# EasyEDA Pro project ProDoc_ESP32_V2_Interface Board_Abed_2025-12-05.epro

# Schematic ESP8266_Interface Schematic

## Sheets
1 Minsys: Board Name: ESP32_V2_Interface Board_Abed; Create Date: 2025-10-08; Page Name: Minsys; Project Name: Pjbl3_2025-2026; Schematic Name: ESP8266_Interface Schematic; Update Date: 2025-10-18; Company: EasyEDA.com; Page Size: A4; Version: V1.0
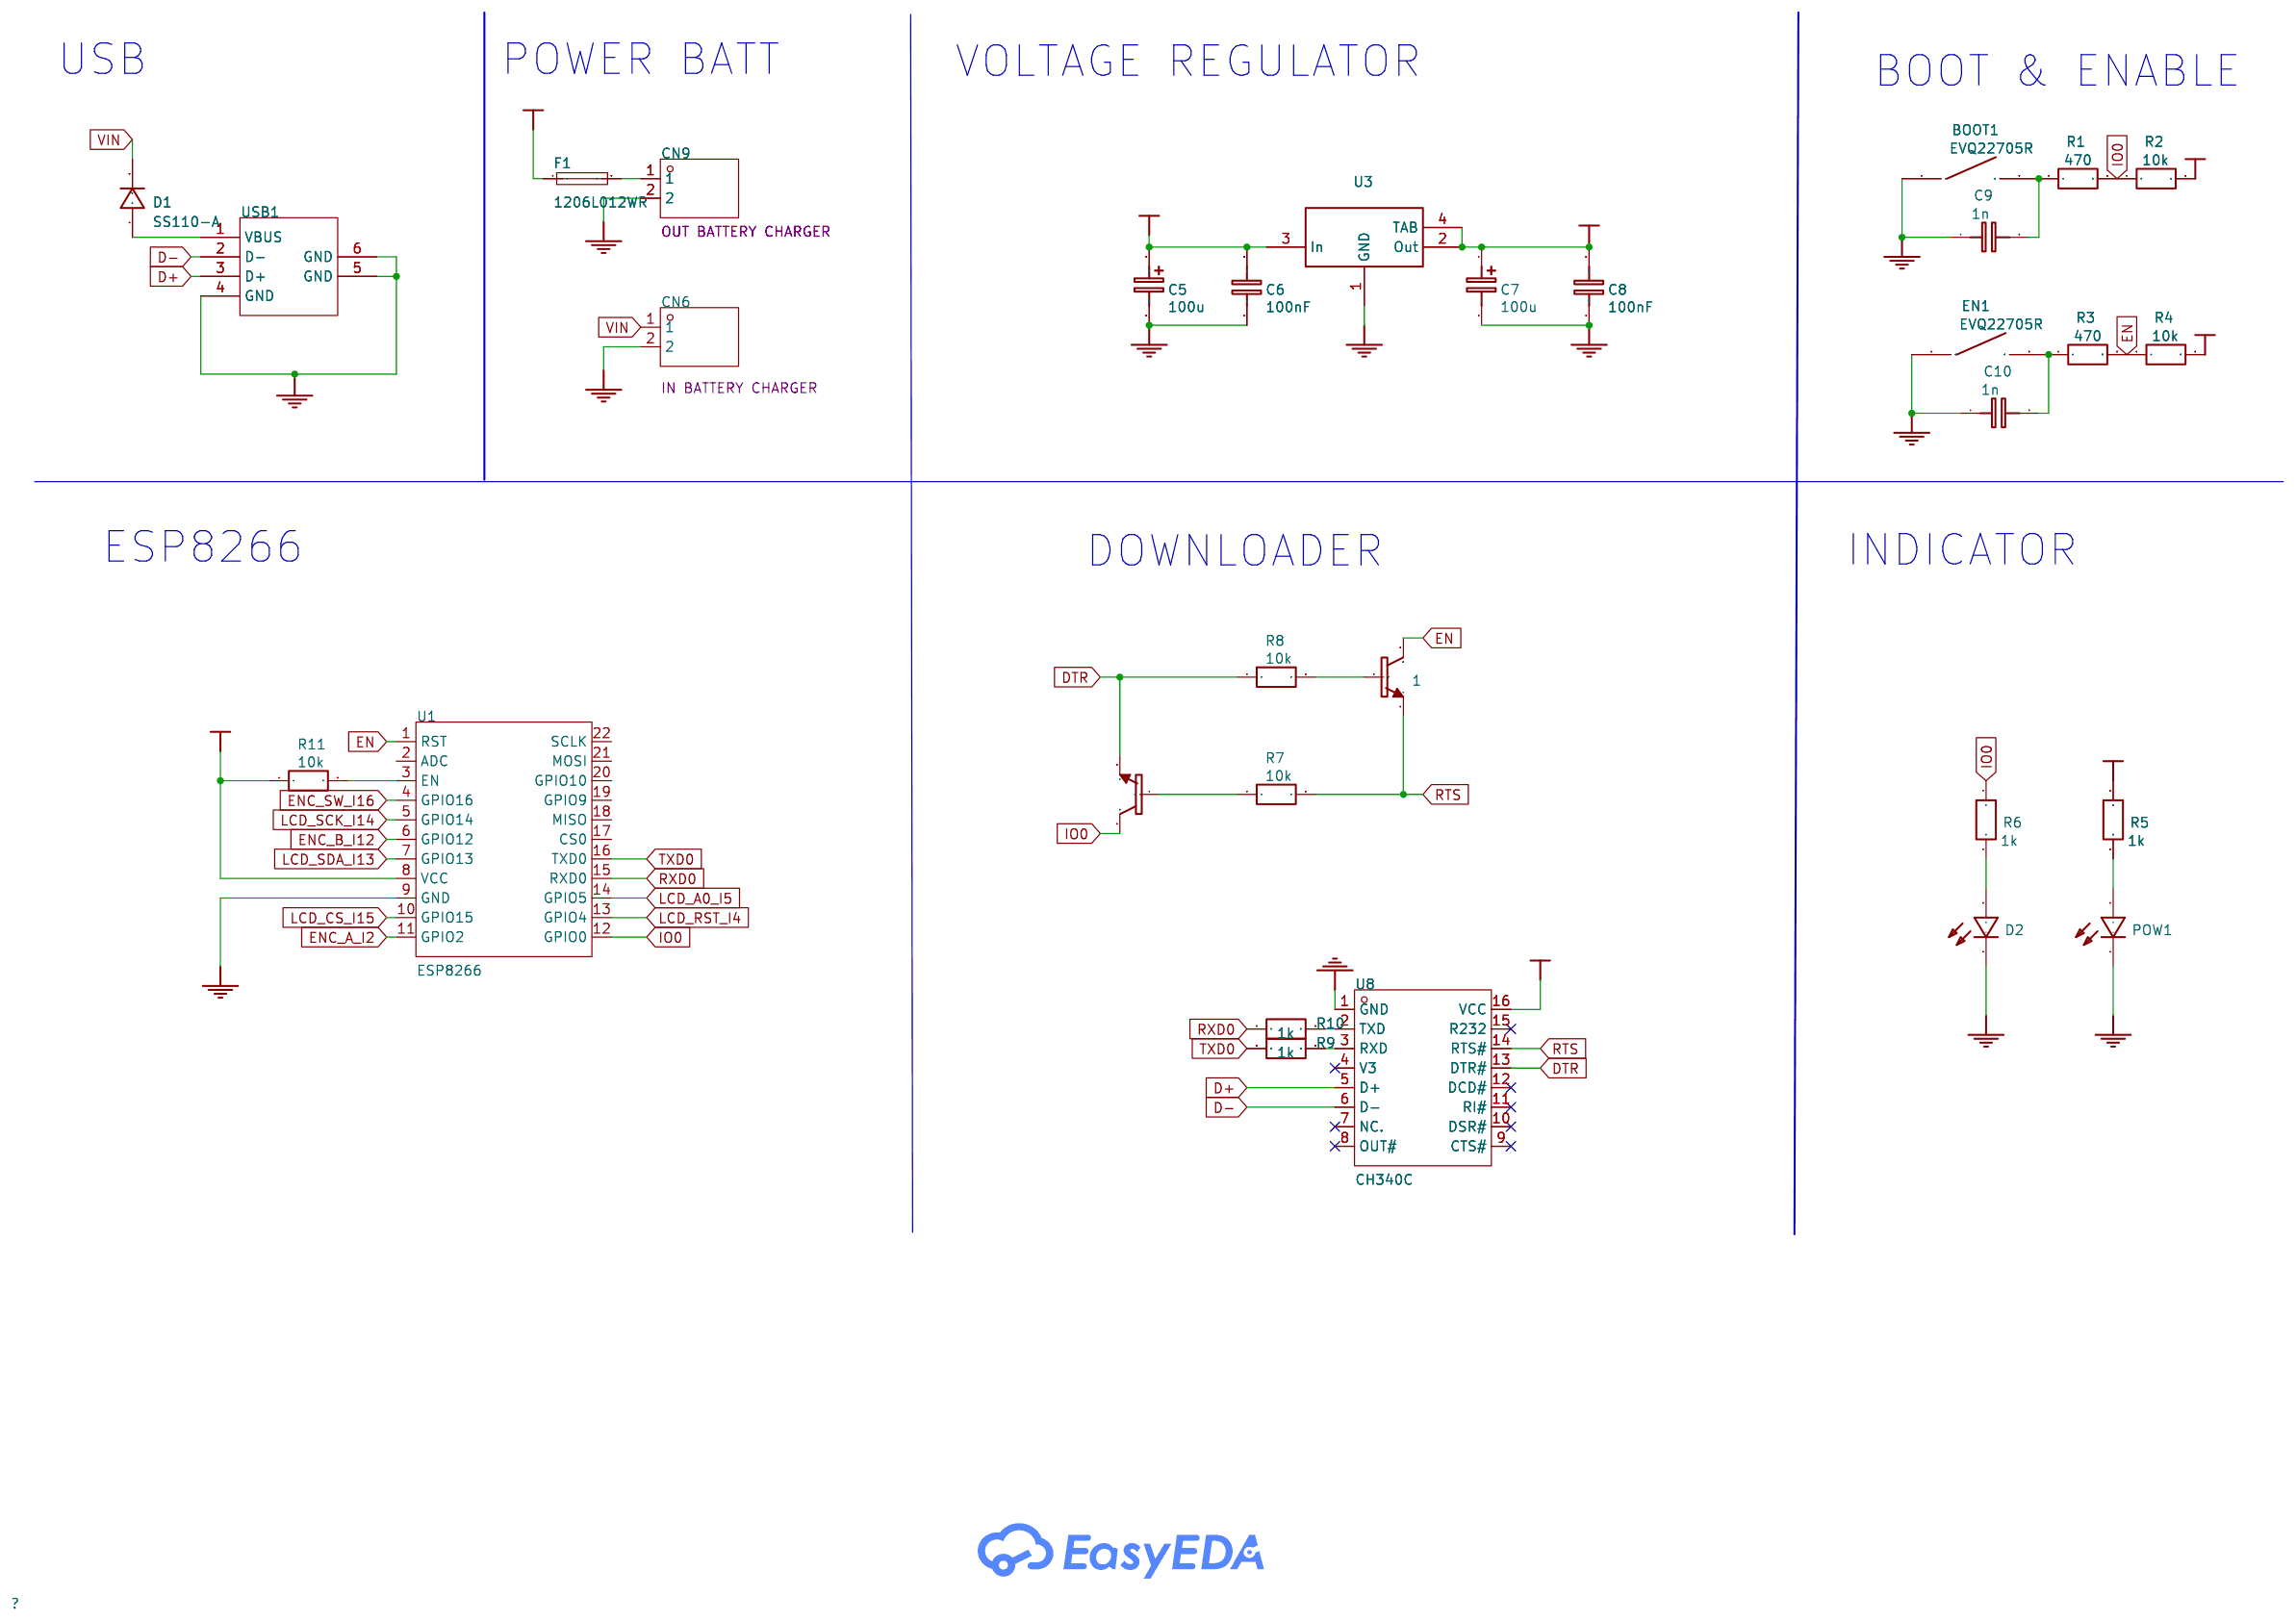
[diagram p0: Minsys]
2 INTERFACE: Page Name: INTERFACE; Schematic Name: ESP32_Interface Schematic; Update Date: 2025-10-09
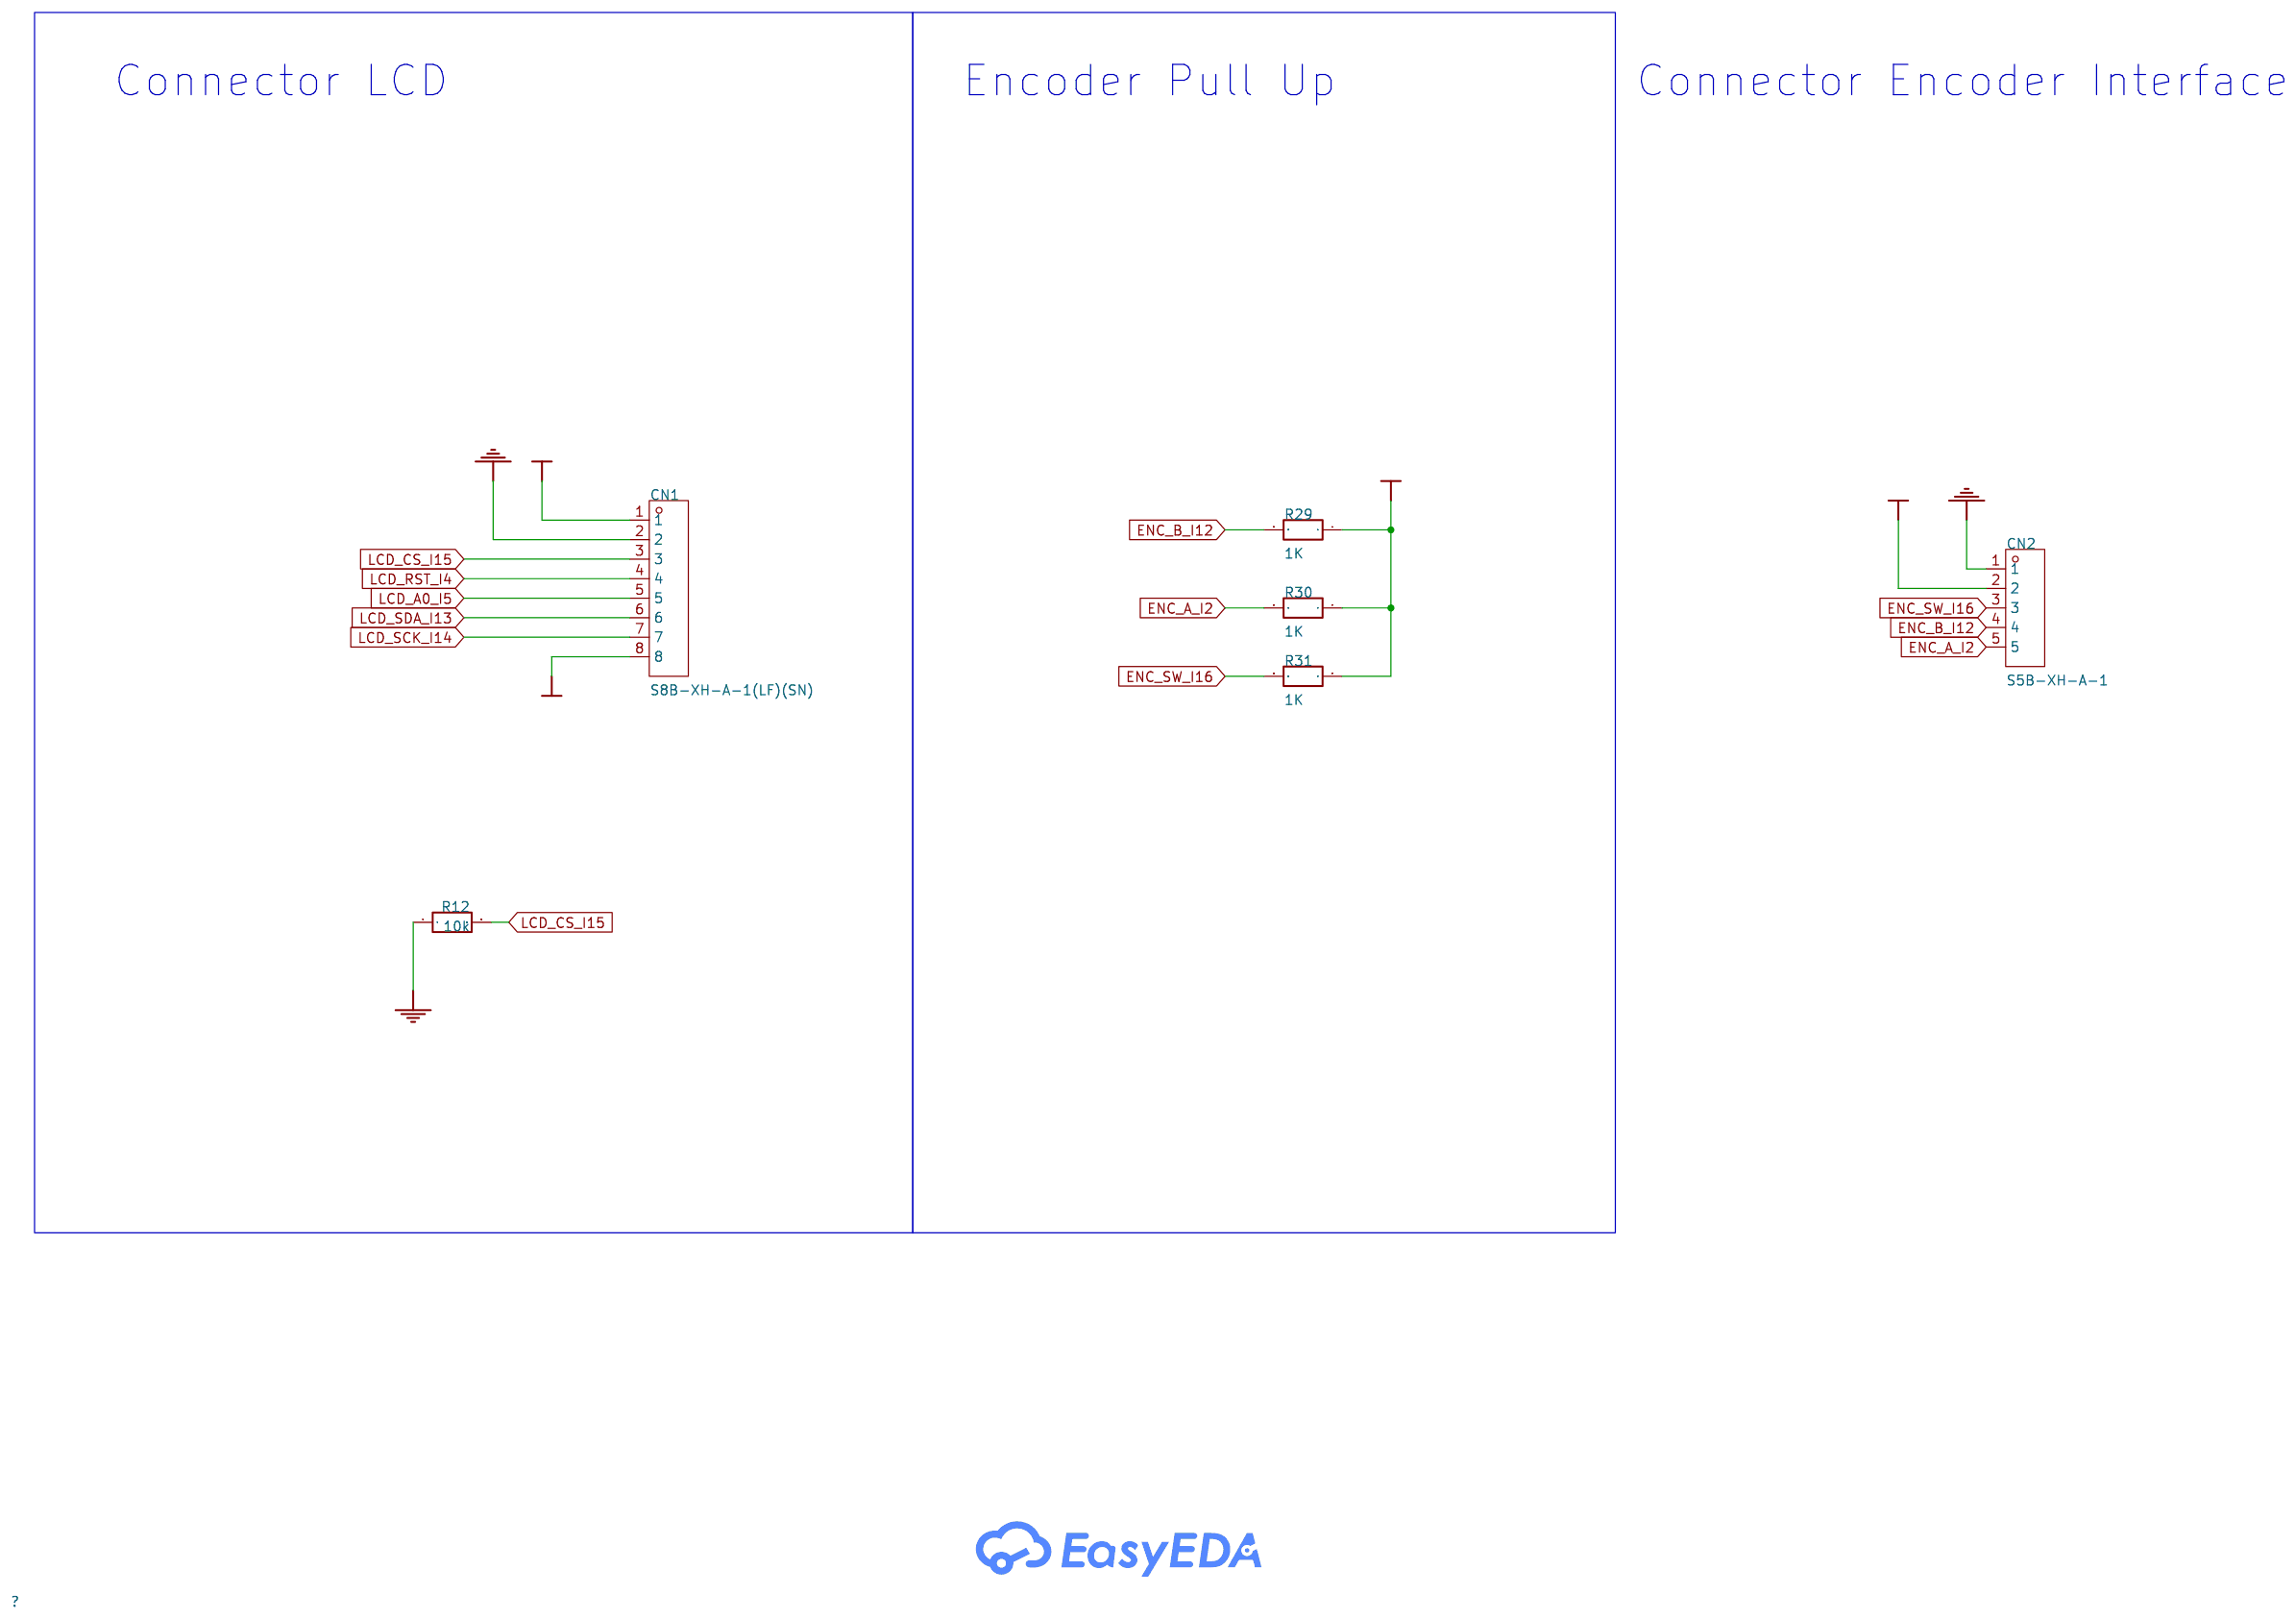
[diagram p1: INTERFACE]

## Parts
sheet INTERFACE
CN1  S8B-XH-A-1(LF)(SN)  [CONN-TH_S8B-XH-A-1-LF-SN]
CN2  S5B-XH-A-1  [CONN-TH_S5B-XH-A-1-LF-SN]
R12  10k  [R0603]
R29  1K  [R0603]
R30  1K  [R0603]
R31  1K  [R0603]
sheet Minsys
1  MMBT3904  [SOT-23-3_L2.9-W1.3-P1.90-LS2.4-BR]
2  MMBT3904  [SOT-23-3_L2.9-W1.3-P1.90-LS2.4-BR]
BOOT1  EVQ22705R  [SMD_PUSH]
C5  100u  [CASE-A_3216]
C6  100nF  [C0603]
C7  100u  [CASE-A_3216]
C8  100nF  [C0603]
C9  1n  [C0603]
C10  1n  [C0603]
CN6  S2B-XH-A-1(LF)(SN)  [CONN-TH_S2B-XH-A-1-LF-SN]
CN9  S2B-XH-A-1(LF)(SN)  [CONN-TH_S2B-XH-A-1-LF-SN]
D1  SS110-A  [D0805]
D2  17-21/BHC-XL2M2TY/3T  [LED0805-RD_BLUE]
EN1  EVQ22705R  [SMD_PUSH]
F1  1206L012WR  [F1206]
POW1  17-21/BHC-XL2M2TY/3T  [LED0805-RD_BLUE]
R1  470  [R0603]
R2  10k  [R0603]
R3  470  [R0603]
R4  10k  [R0603]
R5  1k  [R0603]
R6  1k  [R0603]
R7  10k  [R0603]
R8  10k  [R0603]
R9  1k  [R0603]
R10  1k  [R0603]
R11  10k  [R0603]
U1  ESP8266  [WIFIM-SMD_ESP-12F-ESP8266MOD]
U3  AMS1117-3.3  [SOT-223-3_L6.5-W3.4-P2.30-LS7.0-BR]
U8  CH340C  [SOP-16_L10.0-W3.9-P1.27-LS6.0-BL]
USB1  USB-B01  [USB-B-TH_USB-B01]

## Library data of the parts
CN1 = S8B-XH-A-1(LF)(SN)_C5306549: Pins Structure:1x8P Pitch:2.5mm Mounting Type:Right Angle Reference Series:XH Number of Pins:8P Number of Rows:1 Number of PINs Per Row:8 Row Spacing:- Current Rating:3A Contact Material:Brass Contact Plating:Tin Operating Temperature:-25℃~+85℃ Operating; LCSC Part Name: 1x8P 间距:2.5mm 弯插 系列:XH; Supplier Part: C5306549; Manufacturer: JST; Supplier Footprint: 弯插,P=2.5mm; JLCPCB Part Class: Extended Part; Datasheet: https://item.szlcsc.com/datasheet/S8B-XH-A-1(LF)(SN)/6058854.html; Supplier: LCSC; Pins Structure: 1x8P; Pitch: 2.5mm; Mounting Type: Right Angle; Reference Series: XH; Number of Pins: 8P; Number of Rows: 1; Number of PINs Per Row: 8; Current Rating: 3A; Contact Material: Brass; Contact Plating: Tin; Operating Temperature: -25℃~+85℃; Voltage Rating: 250V; Plastic Material: PA66; Flame Retardant Rating: UL94V-0; Supplementary Features: K Pin; Color: White; Z-Height of the Board: 6.1mm; X-Length of Bottom Edge on Board (Spacing Line): 22.4mm; Y-Width of Bottom Edge on Board: 11.5mm
CN2 = S5B-XH-A-1: Pins Structure:1x5P Pitch:2.5mm Mounting Type:Bend-in Reference Series:XH Number of Pins:5P Number of Rows:1 Number of PINs Per Row:5 Row Spacing:- Current Rating:3A Contact Material:Brass Contact Plating:Tin Operating Temperature:-25℃~+85℃ Operating Temp; LCSC Part Name: 1x5P 间距:2.5mm 弯插 系列:XH; Supplier Part: C20461711; Manufacturer: JST; Supplier Footprint: 弯插,P=2.5mm; Datasheet: https://item.szlcsc.com/datasheet/S5B-XH-A-1/21800327.html; Supplier: LCSC; Pins Structure: 1x5P; Pitch: 2.5mm; Mounting Type: Bend-in; Reference Series: XH; Number of Pins: 5P; Number of Rows: 1; Number of PINs Per Row: 5; Current Rating: 3A; Contact Material: Brass; Contact Plating: Tin; Operating Temperature: -25℃~+85℃; Voltage Rating: 250V; Plastic Material: PA66; Flame Retardant Rating: UL94V-0; Supplementary Features: K-leg punch; Color: White; Z-Height of the Board: 6.1mm; X-Length of Bottom Edge on Board (Spacing Line): 14.9mm; Y-Width of Bottom Edge on Board: 11.5mm
R2 R4 R7 R8 R11 R12 R29-R31 = 10k: nameAlias: Value(Ω); spicePre: R; spiceSymbolName: Res_0805(1/8W)_EU
1 2 = MMBT3904_C18195365: type:NPN Current - Collector(Ic):200mA Collector - Emitter Voltage VCEO:40V Pd - Power Dissipation:200mW Transition frequency(fT):300MHz Current - Collector Cutoff:100nA Vce Saturation(VCE(sat)):300mV@50mA,5mA Emitter-Base Voltage(Vebo):6V Number:1 NPN; LCSC Part Name: NPN 电流:0.2A 电压:40V; Supplier Part: C18195365; Manufacturer: LJ(朗捷); Supplier Footprint: SOT-23; JLCPCB Part Class: Extended Part; Datasheet: https://item.szlcsc.com/datasheet/MMBT3904/19344752.html; Supplier: LCSC; type: NPN; Current - Collector(Ic): 200mA; Collector - Emitter Voltage VCEO: 40V; Pd - Power Dissipation: 200mW; Transition frequency(fT): 300MHz; Current - Collector Cutoff: 100nA; Vce Saturation(VCE(sat)): 300mV@50mA,5mA; Emitter-Base Voltage(Vebo): 6V; Number: 1 NPN
BOOT1 EN1 = EVQ22705R: Supplier: LCSC; Manufacturer: PANASONIC; Supplier Part: C79156; Contributor: LCSC; spicePre: S
C5 C7 = 100u: nameAlias: Value(F); Contributor: LCEDA_Lib; spicePre: C; spiceSymbolName: C_Tan_SMD_A_EU
C6 C8 = 100nF: nameAlias: Value(F); Contributor: LCEDA_Lib; spicePre: C; spiceSymbolName: C_0603_EU
C9 C10 = 1n: nameAlias: Value(F); spicePre: C; spiceSymbolName: Cap_0805_EU
CN6 = S2B-XH-A-1(LF)(SN): IN BATTERY CHARGER; LCSC Part Name: 1x2P 间距:2.5mm 弯插 系列:XH; Supplier Part: C163035; Manufacturer: JST; Supplier Footprint: 弯插,P=2.5mm; JLCPCB Part Class: Extended Part; Datasheet: https://item.szlcsc.com/datasheet/S2B-XH-A-1(LF)(SN)/174416.html; Supplier: LCSC; Pins Structure: 1x2P; Pitch: 2.5mm; Mounting Type: Right Angle; Reference Series: XH; Number of Pins: 2P; Number of Rows: 1; Number of PINs Per Row: 2; Current Rating: 3A; Contact Material: Brass; Contact Plating: Tin; Operating Temperature: -25℃~+85℃; Voltage Rating: 250V; Plastic Material: PA66; Flame Retardant Rating: UL94V-0; Supplementary Features: K Pin; Color: White; Z-Height of the Board: 6.1mm; X-Length of Bottom Edge on Board (Spacing Line): 7.4mm; Y-Width of Bottom Edge on Board: 11.5mm
CN9 = S2B-XH-A-1(LF)(SN): OUT BATTERY CHARGER; LCSC Part Name: 1x2P 间距:2.5mm 弯插 系列:XH; Supplier Part: C163035; Manufacturer: JST; Supplier Footprint: 弯插,P=2.5mm; JLCPCB Part Class: Extended Part; Datasheet: https://item.szlcsc.com/datasheet/S2B-XH-A-1(LF)(SN)/174416.html; Supplier: LCSC; Pins Structure: 1x2P; Pitch: 2.5mm; Mounting Type: Right Angle; Reference Series: XH; Number of Pins: 2P; Number of Rows: 1; Number of PINs Per Row: 2; Current Rating: 3A; Contact Material: Brass; Contact Plating: Tin; Operating Temperature: -25℃~+85℃; Voltage Rating: 250V; Plastic Material: PA66; Flame Retardant Rating: UL94V-0; Supplementary Features: K Pin; Color: White; Z-Height of the Board: 6.1mm; X-Length of Bottom Edge on Board (Spacing Line): 7.4mm; Y-Width of Bottom Edge on Board: 11.5mm
D1 = SS110-A: Supplier Part: C143192; Supplier: LCSC; Manufacturer: FMS; Contributor: LCSC; spicePre: D
D2 POW1 = 17-21/BHC-XL2M2TY/3T: Supplier: LCSC; Manufacturer: EVERLIGHT; image: //image.lceda.cn/szlcsc/C72035.jpg; Supplier Part: C72035; JLCPCB Part Class: Extend; LCSC Assembly: Yes; spicePre: L
F1 = 1206L012WR: Voltage - Max:30V Current - Max:100A Hold Current:125mA Trip Current:290mA Power Dissipation:- Resistance - Initial (Ri) (Min):1.5Ω Resistance - Post Trip (R1) (Max):6Ω Time to Trip(Max):200ms Operating Temperature:-40℃~+85℃ Operating Temperature:-40℃~+85; LCSC Part Name: 30V 125mA 1206自恢复; Supplier Part: C151160; Manufacturer: Littelfuse(美国力特); Supplier Footprint: 1206; Datasheet: https://item.szlcsc.com/datasheet/1206L012WR/162500.html; Supplier: LCSC; Voltage - Max: 30V; Current - Max: 100A; Hold Current: 125mA; Trip Current: 290mA; Resistance - Initial (Ri) (Min): 1.5Ω; Resistance - Post Trip (R1) (Max): 6Ω; Time to Trip(Max): 200ms; Operating Temperature: -40℃~+85℃
R1 R3 = 470: nameAlias: Value(Ω); spicePre: R; spiceSymbolName: Res_0805(1/8W)_EU
R5 R6 = 1k: nameAlias: Value(Ω); spicePre: R; spiceSymbolName: Res_0805(1/8W)_EU
R9 R10 = 1k: nameAlias: Value(Ω); Contributor: LCEDA_Lib; spicePre: R; spiceSymbolName: R_AXIAL-0.5_EU
U1 = ESP8266: Supplier Part: C9900003049; Supplier Footprint: WIFIM-SMD; Supplier: LCSC
U3 = AMS1117-3.3_C18212698: Output Type:Fixed Voltage - Supply:12V Output Voltage:3.3V Output Voltage:3.3V Output Current:1A Power Supply Rejection Ratio (PSRR):- Voltage Dropout:1.3V@(1A) standby current:4mA Noise:- Features:- Operating Temperature:- Operating Temperature:- Output; Supplier Part: C18212698; Manufacturer: TECH PUBLIC(台舟); Supplier Footprint: SOT-223; JLCPCB Part Class: Extended Part; Datasheet: https://item.szlcsc.com/datasheet/AMS1117-3.3/19384486.html; Supplier: LCSC; Output Type: Fixed; Voltage - Supply: 12V; Output Voltage: 3.3V; Output Current: 1A; Voltage Dropout: 1.3V@(1A); standby current: 4mA; Output Configuration: Positive; Number of Outputs: 1
U8 = CH340C: Applications Function:Transceiver USB Protocol:USB 2.0 Voltage - Supply:3.3V；5V Voltage - Supply:3.3V；5V Data Rate:2Mbps Operating Temperature:-20℃~+70℃ Operating Temperature:-20℃~+70℃ Current - Supply:7mA Supply Current (Iq):50uA; LCSC Part Name: USB转串口芯片; Supplier Part: C84681; Manufacturer: WCH(南京沁恒); Supplier Footprint: SOP-16; Datasheet: https://item.szlcsc.com/datasheet/CH340C/85852.html; Supplier: LCSC; Applications Function: Transceiver; USB Protocol: USB 2.0; Voltage - Supply: 3.3V；5V; Data Rate: 2Mbps; Operating Temperature: -20℃~+70℃; Current - Supply: 7mA; Supply Current (Iq): 50uA
USB1 = USB-B01: Connector Type:Type-B Standard:USB 2.0 Gender:Mother Mounting Style:Bend-in Number of Contacts:4P Number of Ports:1 Current Rating - Power (Max):- Operating Temperature Range:- Operating Temperature Range:-; LCSC Part Name: Type-B 母 弯插; Supplier Part: C498173; Manufacturer: SOFNG(硕方); Supplier Footprint: 插件; JLCPCB Part Class: Extended Part; Datasheet: https://atta.szlcsc.com/upload/public/pdf/source/20241205/E91F6EB45793D6E28E6049372FBBC2AE.pdf; Supplier: LCSC; Connector Type: Type-B; Standard: USB 2.0; Gender: Mother; Mounting Style: Bend-in; Number of Contacts: 4P; Number of Ports: 1

## Nets
3V3: C7.1 C8.2 CN1.1 CN2.2 R2.2 R4.2 R5.1 R11.1 R29.1 R30.1 R31.1 U1.8(VCC) U3.2(Out) U3.4(TAB)
+5V: C5.1 C6.2 CN1.8 F1.1 U3.3(In) U8.16(VCC)
GND: BOOT1.1 C5.2 C6.1 C7.2 C8.1 C9.1 C10.1 CN1.2 CN2.1 CN6.2 CN9.2 D2.1(-) EN1.1 POW1.1(-) R12.1 U1.9(GND) U3.1(GND) U8.1(GND) USB1.4(GND) USB1.5(GND) USB1.6(GND)
VIN: CN6.1 D1.2
D+: U8.5(D+) USB1.3(D+)
D-: U8.6(D-) USB1.2(D-)
DTR: 2.3(E) R8.1 U8.13(DTR#)
EN: 1.2(C) R3.2 R4.1 U1.1(RST)
ENC_A_I2: CN2.5 R30.2 U1.11(GPIO2)
ENC_B_I12: CN2.4 R29.2 U1.6(GPIO12)
ENC_SW_I16: CN2.3 R31.2 U1.4(GPIO16)
IO0: 2.2(C) R1.2 R2.1 R6.1 U1.12(GPIO0)
LCD_A0_I5: CN1.5 U1.14(GPIO5)
LCD_CS_I15: CN1.3 R12.2 U1.10(GPIO15)
LCD_RST_I4: CN1.4 U1.13(GPIO4)
LCD_SCK_I14: CN1.7 U1.5(GPIO14)
LCD_SDA_I13: CN1.6 U1.7(GPIO13)
RTS: 1.3(E) R7.2 U8.14(RTS#)
RXD0: R10.1 U1.15(RXD0)
TXD0: R9.1 U1.16(TXD0)
$1N1092: D1.1 USB1.1(VBUS)
$1N1637: 2.1(B) R7.1
$1N1639: 1.1(B) R8.2
$1N1721: R11.2 U1.3(EN)
$1N2228: D2.2(+) R6.2
$1N5068: R9.2 U8.3(RXD)
$1N5069: R10.2 U8.2(TXD)
Net-(BOOT1-2): BOOT1.2 C9.2 R1.1
Net-(C10-2): C10.2 EN1.2 R3.1
Net-(CN9-1): CN9.1 F1.2
Net-(POW1-2): POW1.2(+) R5.2

Not connected (* = marked no-connect by the designer): U1 2(ADC) 17(CS0) 18(MISO) 19(GPIO9) 20(GPIO10) 21(MOSI) 22(SCLK); U8 4(V3)* 7(NC.)* 8(OUT#)* 9(CTS#)* 10(DSR#)* 11(RI#)* 12(DCD#)* 15(R232)*

## Notes on the sheets
sheet 1
- USB
- POWER BATT
- VOLTAGE REGULATOR
- BOOT & ENABLE
- ESP8266
- DOWNLOADER
- INDICATOR
sheet 2
- Connector LCD
- Encoder Pull Up
- Connector Encoder Interface

# Board ESP8266_INTERFACE BOARD
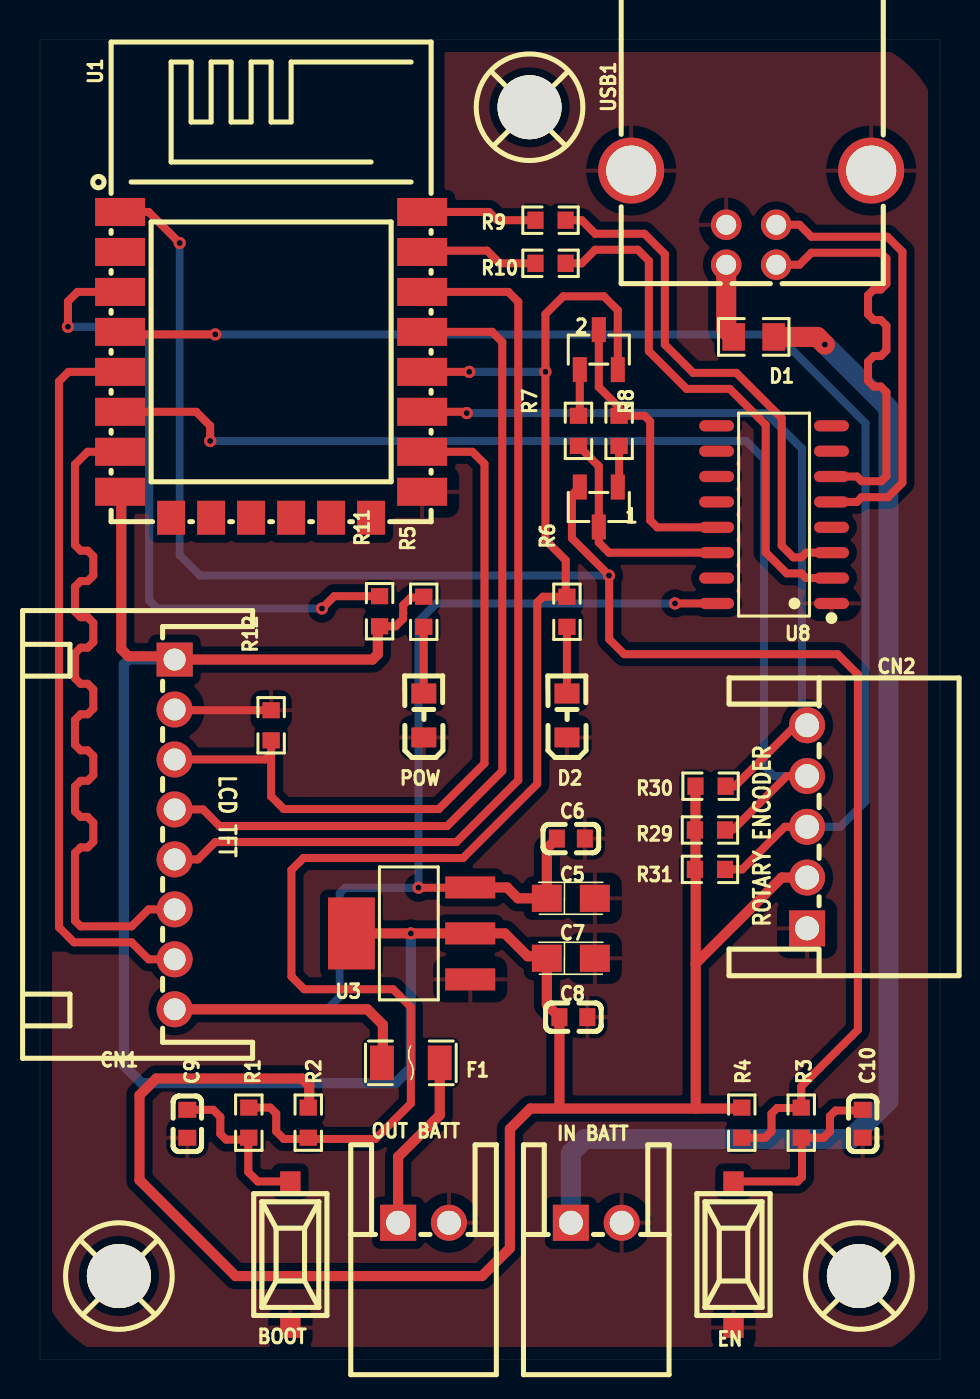
[diagram p2: board, top side]
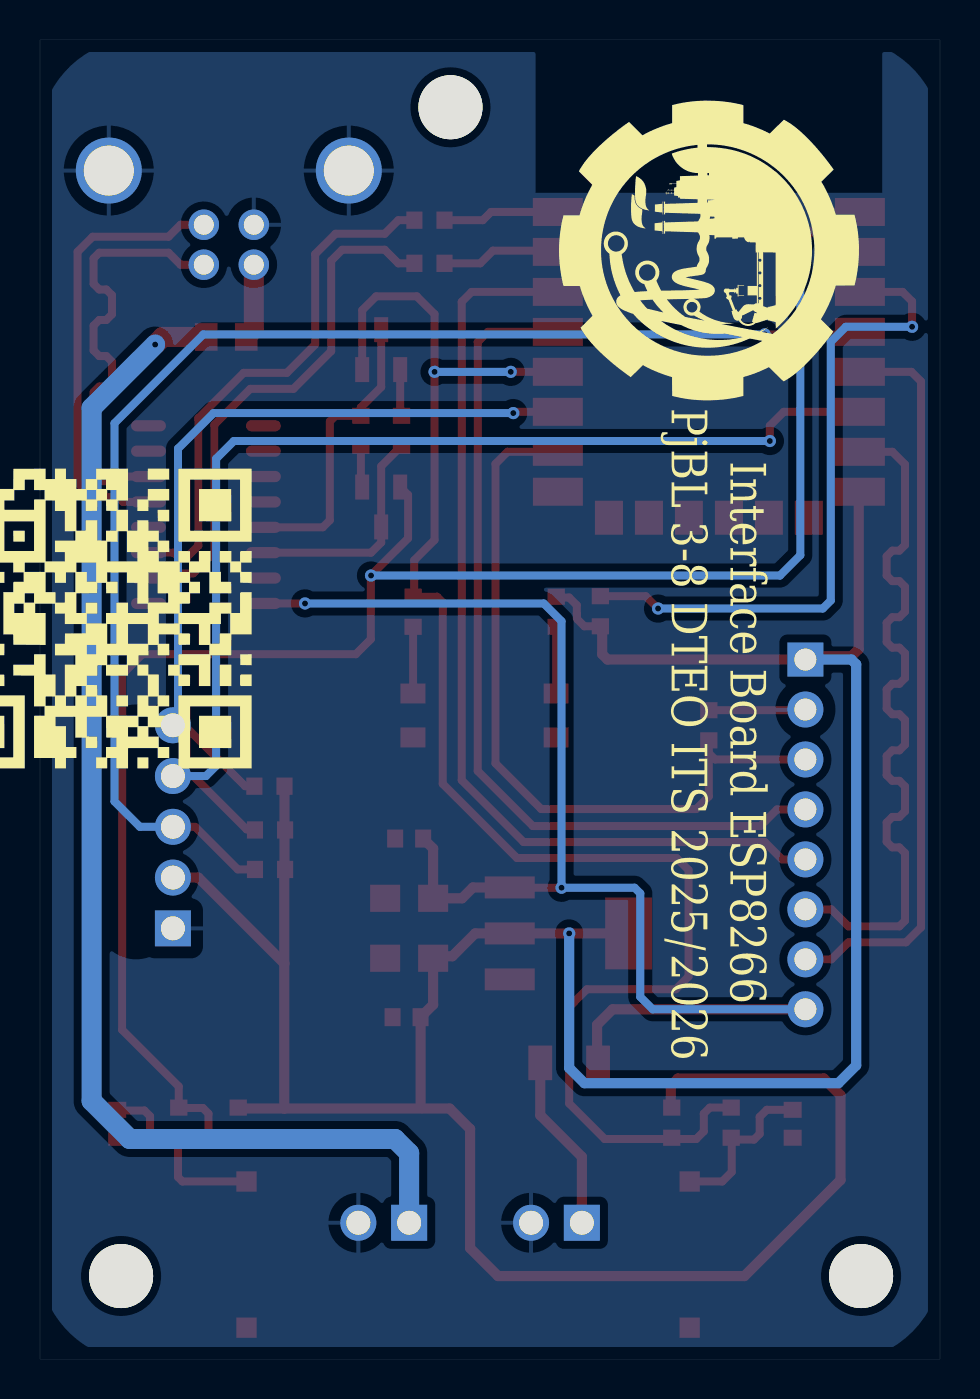
[diagram p3: board, bottom side, seen from below]

Outline 45 x 66 mm; copper layers: Top Layer, Bottom Layer. Coordinates in mm from the lower left corner of the outline.
Outline path: rectangle 0,66 45,0
Stack: Top Layer 0.035mm / Dielectric1 1.51mm FR4 er 4.5 / Bottom Layer 0.035mm

## Design rules (mm)
net LCD_SDA_I13: DP3
net LCD_SCK_I14: DP3
net $1N5068: DP2
net $1N5069: DP2
net D+: DP1
net D-: DP1
template: Custom Config
spacing copperThickness1oz (default): track to track 0.4, other pairs 0.152 to 0.5
spacing copperThickness2oz: track to track 0.203, other pairs 0.152 to 0.3
track width copperThickness1oz (default): min 0.127, default 0.4, max 2.54
track width copperThickness2oz: min 0.203, default 0.254, max 2.54
differential pair differentialPair (default): width min 0.127, default 0.4, max 2.54; gap min 0.4, default 0.4
via viaSize (default): diameter min 0.5, default 0.61, max 10; hole min 0.3, default 0.3, max 6.3
net GND uses gnd
pour e1342 uses gnd

## Placement (name value [footprint] x y rotation side)
1  MMBT3904  [SOT-23-3_L2.9-W1.3-P1.90-LS2.4-BR]  27.94 42.63 90 top
2  MMBT3904  [SOT-23-3_L2.9-W1.3-P1.90-LS2.4-BR]  27.94 50.51 270 top
BOOT  EVQ22705R  [SMD_PUSH]  12.52 5.23 90 top
C5  100u  [CASE-A_3216]  26.54 23.05 0 top
C6  100nF  [C0603]  26.54 26.04 180 top
C7  100u  [CASE-A_3216]  26.54 20.05 0 top
C8  100nF  [C0603]  26.67 17.1 180 top
C9  1n  [C0603]  7.37 11.77 90 top
C10  1n  [C0603]  41.14 11.77 90 top
CN1  S8B-XH-A-1(LF)(SN)  [CONN-TH_S8B-XH-A-1-LF-SN]  6.73 26.25 270 top
CN2  S5B-XH-A-1  [CONN-TH_S5B-XH-A-1-LF-SN]  38.35 26.63 270 top
D1  SS110-A  [D0805]  35.69 51.14 0 top
D2  17-21/BHC-XL2M2TY/3T  [LED0805-RD_BLUE]  26.35 32.2 90 top
EN  EVQ22705R  [SMD_PUSH]  34.68 5.23 90 top
F1  1206L012WR  [F1206]  18.54 14.82 0 top
IN BATT  S2B-XH-A-1(LF)(SN)  [CONN-TH_S2B-XH-A-1-LF-SN]  27.81 6.82 180 top
OUT BATT  S2B-XH-A-1(LF)(SN)  [CONN-TH_S2B-XH-A-1-LF-SN]  19.18 6.82 180 top
POW  17-21/BHC-XL2M2TY/3T  [LED0805-RD_BLUE]  19.19 32.2 90 top
R1  470  [R0603]  10.44 11.83 90 top
R2  10k  [R0603]  13.41 11.83 90 top
R3  470  [R0603]  38.06 11.83 90 top
R4  10k  [R0603]  35.09 11.83 90 top
R5  1k  [R0603]  19.19 37.39 270 top
R6  1k  [R0603]  26.35 37.39 270 top
R7  10k  [R0603]  26.92 46.44 270 top
R8  10k  [R0603]  28.96 46.44 270 top
R9  1k  [R0603]  25.53 56.98 0 top
R10  1k  [R0603]  25.53 54.82 0 top
R11  10k  [R0603]  16.98 37.42 90 top
R12  10k  [R0603]  11.56 31.71 270 top
R29  1K  [R0603]  33.5 26.47 0 top
R30  1K  [R0603]  33.53 28.66 0 top
R31  1K  [R0603]  33.5 24.5 0 top
SCREW1  -  [Screw-Hole-M3]  4.01 4.09 0 top
SCREW2  -  [Screw-Hole-M3]  41.01 4.09 0 top
SCREW3  -  [Screw-Hole-M3]  24.54 62.57 0 top
U1  ESP8266  [WIFIM-SMD_ESP-12F-ESP8266MOD]  11.56 49.74 270 top
U3  AMS1117-3.3  [SOT-223-3_L6.5-W3.4-P2.30-LS7.0-BR]  18.54 21.3 0 top
U8  CH340C  [SOP-16_L10.0-W3.9-P1.27-LS6.0-BL]  36.7 42.25 90 top
USB1  USB-B01  [USB-B-TH_USB-B01]  35.56 57.11 0 top

## Footprints (pads in the part's own frame, mm; a bottom-side part is the same pattern mirrored in y, then rotated)
C0603
  rect 0.8x0.9 smd: 1(-0.7,0) 2(0.7,0)
CASE-A_3216
  rect 1.5x1.359 smd: 1(-1.2,0) 2(1.2,0)
CONN-TH_S2B-XH-A-1-LF-SN
  rect 1.8x1.8 hole 1.2: 1(1.27,0)
  round 1.8 hole 1.2: 2(-1.27,0)
CONN-TH_S5B-XH-A-1-LF-SN
  rect 1.8x1.8 hole 1.2: 1(5.08,0)
  round 1.8 hole 1.2: 2(2.54,0) 3(0,0) 4(-2.54,0) 5(-5.08,0)
CONN-TH_S8B-XH-A-1-LF-SN
  rect 1.7x1.8 hole 1.1: 1(-8.75,0)
  round 1.8 hole 1.1: 2(-6.25,0) 3(-3.75,0) 4(-1.25,0) 5(1.25,0) 6(3.75,0) 7(6.25,0) 8(8.75,0)
D0805
  rect 1.133x1.377 smd: 1(-1,0) 2(1,0)
F1206
  rect 1.19x1.728 smd: 1(-1.445,0) 2(1.445,0)
LED0805-RD_BLUE
  rect 1x1.25 smd: 1(-1.1,0) 2(1.1,0)
R0603
  rect 0.806x0.864 smd: 1(-0.753,0) 2(0.753,0)
Screw-Hole-M3
  round 3.2 hole 3.2: 1(-0.064,0.064)
SMD_PUSH
  rect 1.016x1.016 smd: 1(-3.658,0) 2(3.658,0)
SOP-16_L10.0-W3.9-P1.27-LS6.0-BL
  oval 0.56x1.745 smd: 1(-4.445,-2.873) 2(-3.175,-2.873) 3(-1.905,-2.873) 4(-0.635,-2.873) 5(0.635,-2.873) 6(1.905,-2.873) 7(3.175,-2.873) 8(4.445,-2.873) 9(4.445,2.873) 10(3.175,2.873) 11(1.905,2.873) 12(0.635,2.873) 13(-0.635,2.873) 14(-1.905,2.873) 15(-3.175,2.873) 16(-4.445,2.873)
SOT-23-3_L2.9-W1.3-P1.90-LS2.4-BR
  rect 1.25x0.7 smd: 1(1,-0.95) 2(1,0.95) 3(-1,0)
SOT-223-3_L6.5-W3.4-P2.30-LS7.0-BR
  rect 2.5x1.1 smd: 1(2.97,-2.3) 2(2.97,0) 3(2.97,2.3)
  rect 2.34x3.6 smd: 4(-2.97,0)
USB-B-TH_USB-B01
  round 1.524 hole 1: 1(-1.25,-2.355) 2(1.25,-2.355) 3(1.25,-0.355) 4(-1.25,-0.355)
  round 3.3 hole 2.5: 5(-6,2.355) 6(6,2.355)
WIFIM-SMD_ESP-12F-ESP8266MOD
  rect 1.4x2.5 smd: 1(-7.651,-7.551) 2(-5.651,-7.551) 3(-3.651,-7.551) 4(-1.651,-7.551) 5(0.349,-7.551) 6(2.349,-7.551) 7(4.349,-7.551) 8(6.349,-7.551) 9(6.349,7.548) 10(4.349,7.55) 11(2.349,7.551) 12(0.349,7.551) 13(-1.651,7.55) 14(-3.651,7.551) 15(-5.651,7.551) 16(-7.651,7.551)
  rect 1.7x1.4 smd: 17(7.651,-5) 18(7.649,-3.002) 19(7.649,-1.004) 20(7.649,0.998) 21(7.649,2.997) 22(7.651,4.997)

## Nets
As in the schematic, except:
GND: BOOT.1 C5.2 C6.1 C7.2 C8.1 C9.1 C10.1 CN1.2 CN2.1 D2.1 EN.1 IN BATT.2 OUT BATT.2 POW.1 R12.1 U1.9 U3.1 U8.1 USB1.4 USB1.5 USB1.6
VIN: D1.2 IN BATT.1
$1N2227: POW.2 R5.2
$1N5843: F1.2 OUT BATT.1
$1N6908: C10.2 EN.2 R3.1
$1N6912: BOOT.2 C9.2 R1.1

Pads without a net: SCREW1 1; SCREW2 1; SCREW3 1; U1 2 17 18 19 20 21 22; U8 4 7 8 9 10 11 12 15

## Via types
v1: diameter 0.61, hole 0.3, Top Layer to Bottom Layer, 13 vias

## Routing (per net, layer and track width the routed paths; a pad name or vN(x,y) marks a point on that pad's centre or on a via; arc(x,y) is an arc through that point)
3V3: length 164.9
  Top Layer w0.4: R5.1 19.15,38.1 18.54,38.1 18.16,37.72 18.16,37.29 18.16,37.29 18.16,37.04 17.78,36.66 R11.1
  Top Layer w0.508: U1.8 4.06,43.34 4.06,35.52 4.42,35.16 6.57,35.16 CN1.1 16.62,35 16.89,35.27 16.89,36.57 R11.1 ; R2.2 13.46,12.63 13.46,13.68 13.1,14.03 5.81,14.03 4.97,13.2 4.97,8.95 9.78,4.15 22.1,4.15 23.5,5.55 23.5,11.51 24.52,12.53 25.81,12.53 ; CN2.2 37.08,24.09 32.79,19.79 ; 25.97,12.63 C8.2 25.34,17.73 C7.1 25.24,20.15 24.38,20.15 23.24,21.3 U3.2 v1(18.54,21.3) U3.4 ; 32.79,12.53 35.04,12.53 R4.2 ; 32.79,12.53 32.79,19.79 ; 32.79,12.53 25.94,12.53 ; R30.1 32.77,24.53 R31.1 32.79,24.46 32.79,19.79
  Bottom Layer w0.508: CN1.1 4.43,35 4.19,34.76 4.19,14.69 5.08,13.8 17.78,13.8 18.54,14.56 v1(18.54,21.3)
+5V: length 68.9
  Top Layer w0.4: U3.3 21.5,23.58 v1(18.92,23.58) ; U8.16 v1(31.75,37.81)
  Top Layer w0.508: CN1.8 16.37,17.5 17.15,16.72 17.15,14.87 F1.1 ; U3.3 23.35,23.6 23.9,23.05 C5.1 25.34,25.54 C6.2
  Bottom Layer w0.4: v1(31.75,37.81) 19.81,37.81 18.92,36.92 v1(18.92,23.58) 15.27,23.58 14.99,23.3 14.99,18.12 14.36,17.5 CN1.8
GND: length 4.8
  Top Layer w0.4: R12.1 6.77,32.46 CN1.2
VIN: length 62.3
  Top Layer w1.001: D1.2 38.86,51.14 v1(39.24,50.76)
  Bottom Layer w1.001: 26.54,6.82 26.54,10.3 27.25,11.01 40.51,11.01 42.42,12.91 42.42,47.58 v1(39.24,50.76)
D+: length 22.4
  Top Layer w0.4: U8.5 40.85,42.89 41.08,43.12 42.4,43.12 43.12,43.84 43.12,55.4 42.37,56.15 38.57,56.15 37.97,56.75 USB1.3
D-: length 22.1
  Top Layer w0.4: U8.6 40.85,44.16 41.08,43.92 42.07,43.92 42.32,44.17 42.32,48.38 42.04,48.66 41.69,48.66 41.4,48.94 41.4,49.9 41.69,50.18 42.04,50.18 42.32,50.47 42.32,51.71 42.04,51.99 41.69,51.99 41.4,52.27 41.4,53.23 41.69,53.51 42.04,53.51 42.32,53.8 42.32,55.07 42.04,55.35 38.57,55.35 37.97,54.75 USB1.2
DTR: length 14.8
  Top Layer w0.4: 2.3 27.94,48.63 28.96,47.62 R8.1 30.23,47.2 30.51,46.91 30.51,41.97 30.86,41.62 U8.13
EN: length 89.8
  Top Layer w0.4: 28.46,39.2 28.46,36.02 29.21,35.27 39.88,35.27 40.89,34.25 40.89,16.47 38.06,13.64 R3.2 38.04,12.56 36.86,12.56 36.58,12.28 36.58,11.39 36.26,11.07 R4.1 ; 28.46,39.2 26.6,41.07 26.6,43.24 1.2 ; 28.46,39.2 v1(28.45,39.2) ; v1(6.98,55.84) 5.43,57.39 U1.1
  Bottom Layer w0.4: v1(28.45,39.2) 8,39.2 6.98,40.22 v1(6.98,55.84)
ENC_A_I2: length 39
  Top Layer w0.4: U1.11 21.27,47.39 v1(21.34,47.33) ; R30.2 34.74,28.66 37.79,31.71 CN2.5
  Bottom Layer w0.4: v1(21.34,47.33) 36.32,47.33 38.1,45.55 38.1,31.96 CN2.5
ENC_B_I12: length 56.6
  Top Layer w0.4: v1(8.51,45.93) 8.51,46.7 7.81,47.39 U1.6 ; R29.2 34.28,26.5 34.67,26.5 37.34,29.17 38.35,29.17
  Bottom Layer w0.4: v1(8.51,45.93) 35.31,45.93 36.19,45.04 36.19,29.68 36.7,29.17 38.35,29.17
ENC_SW_I16: length 66.5
  Top Layer w0.4: CN2.3 37.24,26.63 35.11,24.5 R31.2 ; v1(8.76,51.27) 4.13,51.27 U1.4
  Bottom Layer w0.4: v1(8.76,51.27) 36.83,51.27 41.28,46.82 41.28,27.9 40,26.63 CN2.3
IO0: length 79.6
  Top Layer w0.4: R1.2 11.51,12.58 11.81,12.28 11.81,11.39 12.19,11.01 13.35,11.01 R2.1 13.48,11.01 16.76,11.01 18.54,12.79 18.54,17.61 17.65,18.5 13.21,18.5 12.57,19.14 12.57,24.47 13.17,25.07 21.15,25.07 24.86,28.78 24.86,37.86 25.15,38.14 R6.1 26.29,38.2 26.29,39.96 25.27,40.98 v1(25.27,49.39) 25.27,52.28 26.16,53.17 28.19,53.17 28.89,52.48 2.2 ; U1.12 v1(21.46,49.39)
  Bottom Layer w0.4: v1(21.46,49.39) v1(25.27,49.39)
LCD_A0_I5: length 47.8
  Top Layer w0.4: CN1.5 7.89,25 8.76,25.87 20.82,25.87 23.91,28.96 23.91,52.9 23.42,53.39 U1.14
LCD_CS_I15: length 38
  Top Layer w0.4: CN1.3 11.24,30 11.56,30.31 ; 11.56,30.31 11.56,28.15 12.19,27.52 19.94,27.52 22.22,29.8 22.22,44.79 21.62,45.39 U1.10 ; 11.56,30.31 R12.2
LCD_RST_I4: length 43.5
  Top Layer w0.4: U1.13 22.61,51.39 23.11,50.89 23.11,29.42 20.36,26.67 8.98,26.67 8.15,27.5 CN1.4
LCD_SCK_I14: length 37
  Top Layer w0.4: U1.5 1.43,49.39 0.95,48.91 0.95,21.6 1.7,20.85 4.58,20.85 5.43,20 CN1.7
LCD_SDA_I13: length 36.7
  Top Layer w0.4: U1.7 2.38,45.39 1.75,44.76 1.75,40.73 2.03,40.45 2.38,40.45 2.67,40.16 2.67,39.21 2.38,38.92 2.03,38.92 1.75,38.64 1.75,37.4 2.03,37.12 2.38,37.12 2.67,36.83 2.67,35.88 2.38,35.59 2.03,35.59 1.75,35.31 1.75,34.07 2.03,33.79 2.38,33.79 2.67,33.5 2.67,32.54 2.38,32.26 2.03,32.26 1.75,31.98 1.75,30.74 2.03,30.45 2.38,30.45 2.67,30.17 2.67,29.21 2.38,28.93 2.03,28.93 1.75,28.65 1.75,27.41 2.03,27.12 2.38,27.12 2.67,26.84 2.67,25.88 2.38,25.6 2.03,25.6 1.75,25.32 1.75,21.93 2.03,21.65 4.58,21.65 5.43,22.5 CN1.6
RTS: length 11.4
  Top Layer w0.4: R7.2 27.94,44.67 1.3 27.94,40.85 28.45,40.35 U8.14
RXD0: length 6
  Top Layer w0.4: U1.15 19.17,55.46 22.35,55.46 22.99,54.82 R10.1
TXD0: length 5.8
  Top Layer w0.4: U1.16 22.45,57.39 22.86,56.98 R9.1
$1N1092: length 3.8
  Top Layer w1.001: USB1.1 34.31,51.52 D1.1
$1N1637: length 2.3
  Top Layer w0.4: R7.1 26.99,47.26 2.1
$1N1639: length 2.1
  Top Layer w0.4: R8.2 28.96,43.7 1.1
$1N1721: length 33.3
  Top Layer w0.4: 17.11,38.17 14.71,38.17 14.22,37.68 ; v1(1.4,51.65) 1.4,52.92 1.87,53.39 U1.3
  Bottom Layer w0.4: v1(14.1,37.55) 5.86,37.55 5.46,37.95 5.46,50.9 4.71,51.65 v1(1.4,51.65)
$1N2227: length 3.3
  Top Layer w0.4: POW.2 19.19,33.3 R5.2
$1N2228: length 3.3
  Top Layer w0.4: 26.34,33.3 26.35,33.3 ; R6.2 26.35,33.3
$1N5068: length 26.8
  Top Layer w0.4: R9.2 27.08,56.98 27.76,56.3 30.22,56.3 31.24,55.28 31.24,50.76 32.66,49.34 34.82,49.34 37.08,47.08 37.08,40.69 37.67,40.11 38.07,40.11 38.3,40.35 U8.3
$1N5069: length 26.8
  Top Layer w0.4: U8.2 38.3,39.08 38.07,39.31 37.34,39.31 36.28,40.36 36.28,46.75 34.49,48.54 32.33,48.54 30.44,50.43 30.44,54.95 29.89,55.5 27.76,55.5 27.08,54.82 R10.2
$1N5843: length 8.9
  Top Layer w0.508: 17.91,6.82 17.91,10.12 19.99,12.2 F1.2
$1N6908: length 9.6
  Top Layer w0.4: EN.2 37.88,8.88 38.1,9.1 38.1,11.04 R3.1 39.18,11.07 39.5,11.39 39.5,12.15 39.78,12.43 41.1,12.43 C10.2
$1N6912: length 8.2
  Top Layer w0.4: C9.2 8.66,12.47 9.02,12.11 9.02,11.26 9.3,10.98 10.35,10.98 ; 10.35,10.98 R1.1 ; 10.35,10.98 10.41,10.91 10.41,9.36 10.89,8.88 BOOT.2

## Copper pours and planes (outline as drawn; the poured copper is in the pictures)
GND on Top Layer: 0,61 0.01,61.34 0.06,61.78 0.15,62.22 0.28,62.65 0.45,63.07 0.65,63.47 0.89,63.85 1.16,64.2 1.46,64.54 1.8,64.84 2.15,65.11 2.53,65.35 2.93,65.55 3.35,65.72 3.78,65.85 4.22,65.94 4.66,65.99 5,66 39.96,66 40.29,65.99 40.74,65.94 41.18,65.85 41.61,65.72 42.03,65.55 42.43,65.35 42.81,65.11 43.16,64.84 43.49,64.54 43.8,64.2 44.07,63.85 44.31,63.47 44.51,63.07 44.68,62.65 44.81,62.22 44.9,61.78 44.95,61.34 44.96,61 44.96,4.96 44.95,4.62 44.9,4.18 44.81,3.74 44.68,3.31 44.51,2.89 44.31,2.49 44.07,2.11 43.8,1.76 43.49,1.42 43.16,1.12 42.81,0.85 42.43,0.61 42.03,0.41 41.61,0.24 41.18,0.11 40.74,0.02 40.29,-0.03 39.96,-0.04 5,-0.04 4.66,-0.03 4.22,0.02 3.78,0.11 3.35,0.24 2.93,0.41 2.53,0.61 2.15,0.85 1.8,1.12 1.46,1.42 1.16,1.76 0.89,2.11 0.65,2.49 0.45,2.89 0.28,3.31 0.15,3.74 0.06,4.18 0.01,4.62 0,4.96
GND on Bottom Layer: 0,61 0.01,61.34 0.06,61.78 0.15,62.22 0.28,62.65 0.45,63.07 0.65,63.47 0.89,63.85 1.16,64.2 1.46,64.54 1.8,64.84 2.15,65.11 2.53,65.35 2.93,65.55 3.35,65.72 3.78,65.85 4.22,65.94 4.66,65.99 5,66 39.96,66 40.29,65.99 40.74,65.94 41.18,65.85 41.61,65.72 42.03,65.55 42.43,65.35 42.81,65.11 43.16,64.84 43.49,64.54 43.8,64.2 44.07,63.85 44.31,63.47 44.51,63.07 44.68,62.65 44.81,62.22 44.9,61.78 44.95,61.34 44.96,61 44.96,4.96 44.95,4.62 44.9,4.18 44.81,3.74 44.68,3.31 44.51,2.89 44.31,2.49 44.07,2.11 43.8,1.76 43.49,1.42 43.16,1.12 42.81,0.85 42.43,0.61 42.03,0.41 41.61,0.24 41.18,0.11 40.74,0.02 40.29,-0.03 39.96,-0.04 5,-0.04 4.66,-0.03 4.22,0.02 3.78,0.11 3.35,0.24 2.93,0.41 2.53,0.61 2.15,0.85 1.8,1.12 1.46,1.42 1.16,1.76 0.89,2.11 0.65,2.49 0.45,2.89 0.28,3.31 0.15,3.74 0.06,4.18 0.01,4.62 0,4.96

## Text on the board
Bottom Silkscreen Layer: Interface Board ESP8266 / PjBL 3-8 DTEO ITS 2025/2026
Top Silkscreen Layer: ROTARY ENCODER | LCD TFT
